# Altium schematic sheet External_Stepper.SchDoc
size B; Author: AM; CompanyName: Expatria Technologies; DrawnBy: A.Marles; Engineer: AM; Organization: Expatria Technolgoies; Address1: PO Box 2084; Address3: Merritt, BC V1K 1B8; Address4: Canada; DocumentNumber: 16; Revision: A2; SheetNumber: 13; SheetTotal: 26
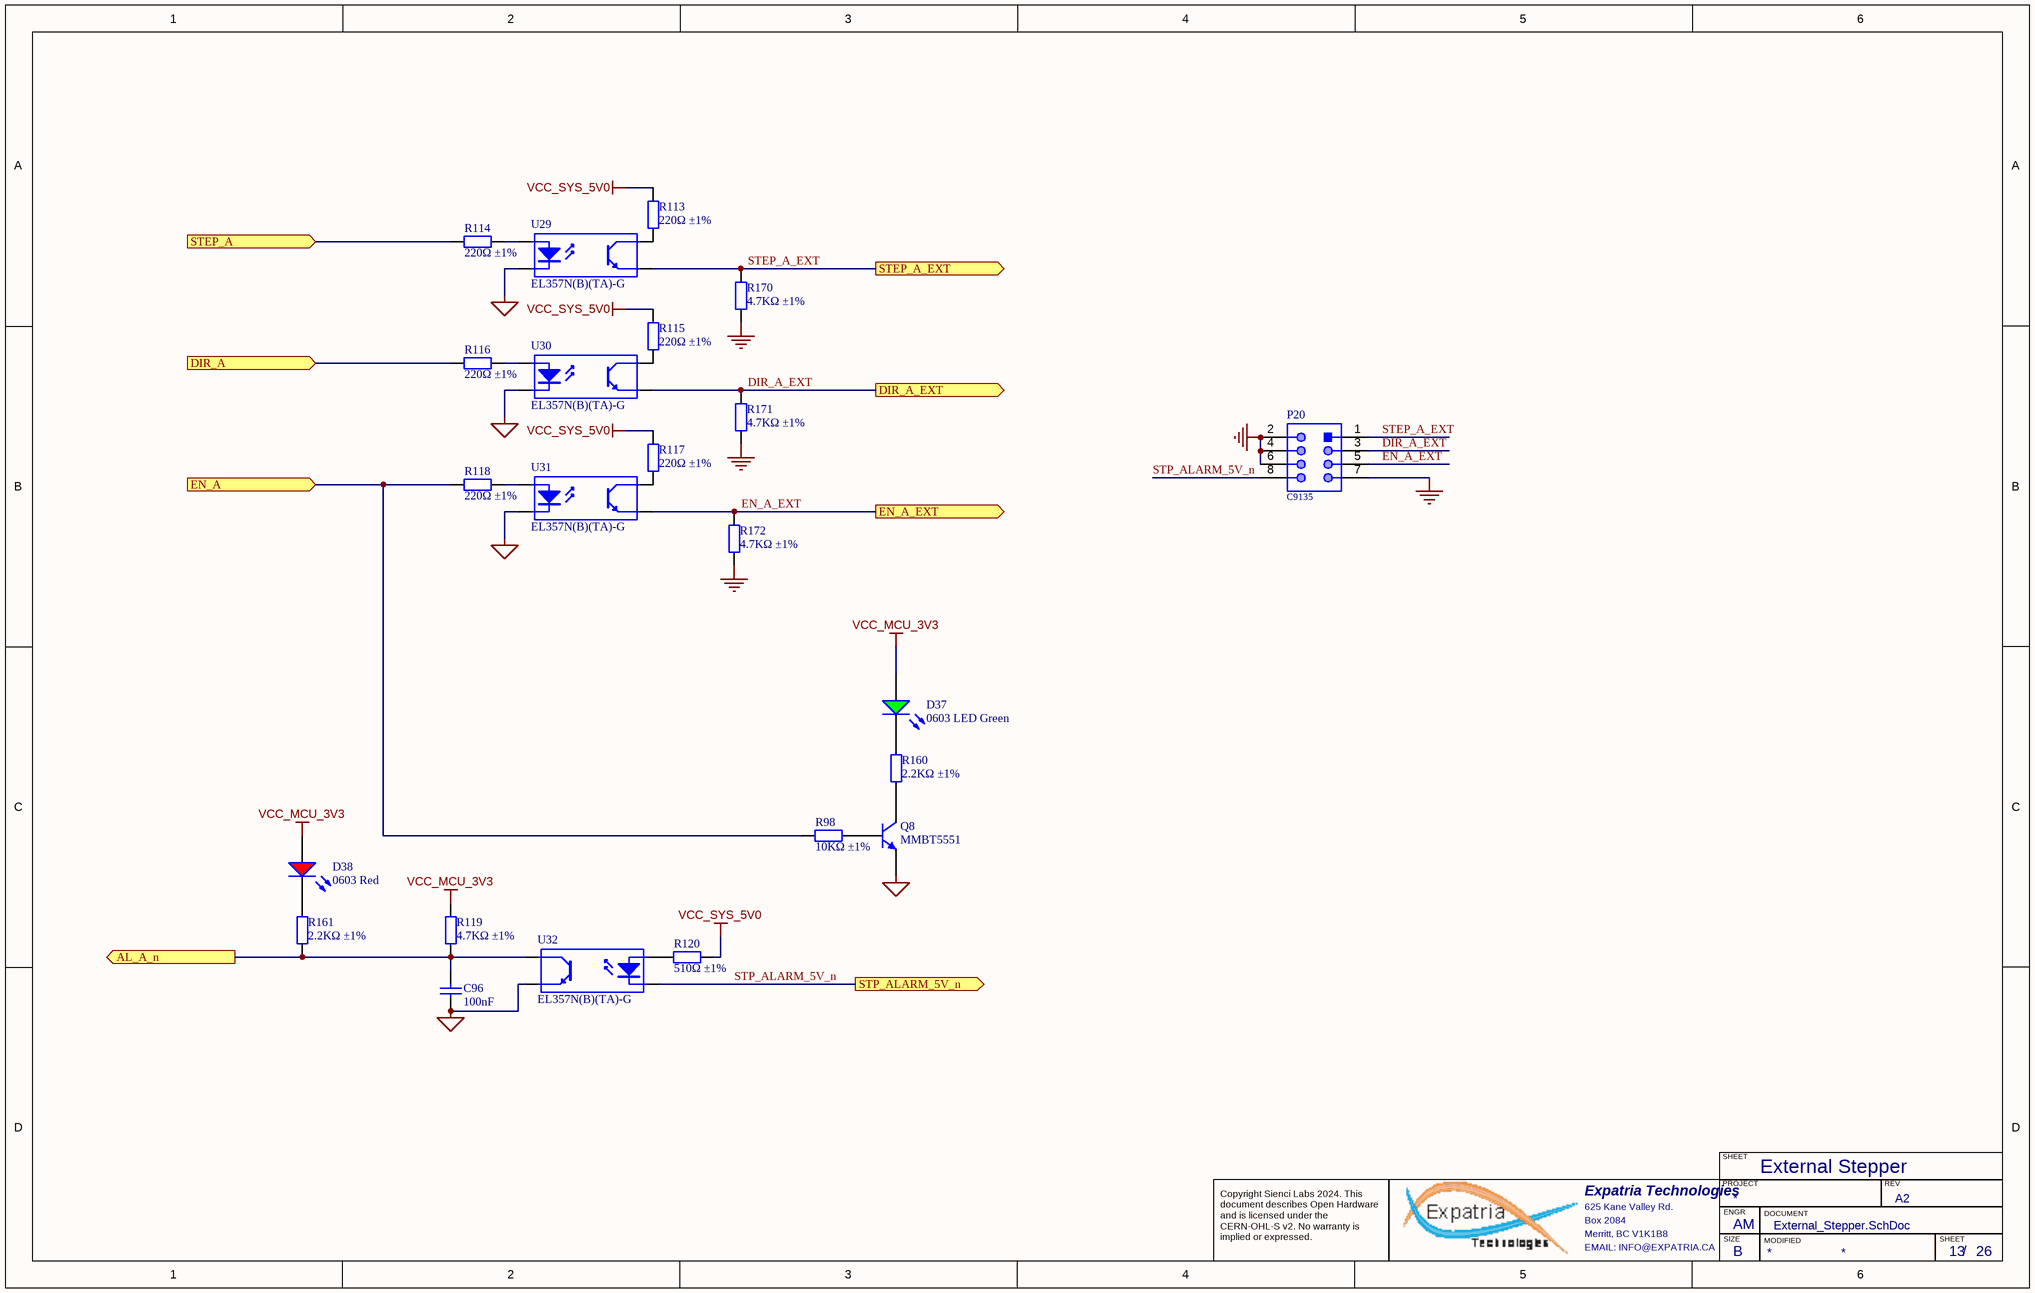
[diagram p0: External_Stepper.SchDoc]

## Parts
C96  100nF  [0402_C]
D37  0603 LED Green  [0603_LED_S1 - GREEN]
D38  0603 Red  [0603_LED_S1]
P20  C9135  [61200821621]
Q8  MMBT5551  [SOT-23(SOT-23-3)]
R98  10KΩ ±1%  [0603_R]
R113  220Ω ±1%  [0402_R]
R114  220Ω ±1%  [0402_R]
R115  220Ω ±1%  [0402_R]
R116  220Ω ±1%  [0402_R]
R117  220Ω ±1%  [0402_R]
R118  220Ω ±1%  [0402_R]
R119  4.7KΩ ±1%  [0402_R]
R120  510Ω ±1%  [0402_R]
R160  2.2KΩ ±1%  [0402_R]
R161  2.2KΩ ±1%  [0402_R]
R170  4.7KΩ ±1%  [0402_R]
R171  4.7KΩ ±1%  [0402_R]
R172  4.7KΩ ±1%  [0402_R]
U29  EL357N(B)(TA)-G  [SOP-4_P2.54]
U30  EL357N(B)(TA)-G  [SOP-4_P2.54]
U31  EL357N(B)(TA)-G  [SOP-4_P2.54]
U32  EL357N(B)(TA)-G  [SOP-4_P2.54]

## Ports
AL_A_n (out), DIR_A (in), DIR_A_EXT (out), EN_A (in), EN_A_EXT (out), STEP_A (in), STEP_A_EXT (out), STP_ALARM_5V_n (out)

## Nets
GND: P20.2 P20.4 P20.6 P20.7 R170.2 R171.2 R172.2
MCU_GND: C96.1 Q8.2(E) U29.2(K) U30.2(K) U31.2(K) U32.3(E)
VCC_MCU_3V3: D37.A D38.A R119.2
VCC_SYS_5V0: R113.1 R115.1 R117.1 R120.2
AL_A_n: C96.2 R119.1 R161.1 U32.4(C) ; port AL_A_n
DIR_A: R116.1 ; port DIR_A
DIR_A_EXT: P20.3 R171.1 U30.3(E) ; port DIR_A_EXT
EN_A: R98.2 R118.1 ; port EN_A
EN_A_EXT: P20.5 R172.1 U31.3(E) ; port EN_A_EXT
STEP_A: R114.1 ; port STEP_A
STEP_A_EXT: P20.1 R170.1 U29.3(E) ; port STEP_A_EXT
STP_ALARM_5V_n: P20.8 U32.2(K) ; port STP_ALARM_5V_n
NetD37_K: D37.K R160.2
NetD38_K: D38.K R161.2
NetQ8_1: Q8.1(B) R98.1
NetQ8_3: Q8.3(C) R160.1
NetR113_2: R113.2 U29.4(C)
NetR114_2: R114.2 U29.1(A)
NetR115_2: R115.2 U30.4(C)
NetR116_2: R116.2 U30.1(A)
NetR117_2: R117.2 U31.4(C)
NetR118_2: R118.2 U31.1(A)
NetR120_1: R120.1 U32.1(A)

## Notes on the sheet
- External Stepper
- SHEET
- Expatria Technologies
- 625 Kane Valley Rd.
- Box 2084
- Merritt, BC V1K1B8
- PROJECT
- SIZE
- ENGR
- MODIFIED
- DOCUMENT
- REV
- Copyright Sienci Labs 2024. This document describes Open Hardware and is licensed under the CERN-OHL-S v2. No warranty is implied or expressed.
- EMAIL: INFO@EXPATRIA.CA
- B
- /

## Library data of the parts
C96 = 0402 100nF (104) 10% 16V: 16V 100nF X7R ±10% 0402 Multilayer Ceramic Capacitors MLCC - SMD/SMT ROHS; Manufacturer: Samsung Electro-Mechanics; Manufacturer Part Number: CL05B104KO5NNNC; ComponentLink1Description: Supplier link; ComponentLink1URL: http://www.szlcsc.com/product/details_1877.html; Package: 0402; Supplier: LC; SuppliersPartNumber: C1525; Capacitance: 100nF; Tolerance: 10%; Voltage: 16V
D37 = 19-217/GHC-YR1S2/3T: Colorless transparence -40℃~+85℃ 520nm~535nm Emerald 120° 110mW 0603 Light Emitting Diodes (LED) ROHS; Manufacturer: Everlight Elec; Package: 0603; Supplier: LC; SuppliersPartNumber: C72043; Color: Green; Manufacturer Part Number: 19-217/GHC-YR1S2/3T
D38 = 19-213SURC/S530-A3/TR8: 20mA 632nm Colorless transparence 624nm~624nm -40℃~+85℃ Red 120° 60mW 0603 Light Emitting Diodes (LED) ROHS; Manufacturer: Everlight Elec; Package: 0603; Supplier: LC; SuppliersPartNumber: C72039; Color: Red; ComponentLink1Description: 供应商链接; ComponentLink1URL: http://www.szlcsc.com/product/details_2659.html; Supplier 1: LC; Supplier Part Number 1: C72039; Manufacturer Part Number: 19-213SURC/S530-A3/TR8
P20 = HDR2x4P: Male Box Header WR-BHD, THT, Vertical, pitch 2.54 mm, 8 pins; Manufacturer: Wurth Electronics; Pitch: 2.54mm; Publisher: WurthElektronik; Manufacturer Part Number: C9135; Packaging: Tray; Published Date: August2018; Manufacturer Part Number: 61200821621; SuppliersPartNumber: C9135; Supplier: LCSC
Q8 = MMBT5551: 50nA 160V 300mW 200@10mA,5V 600mA 100MHz 200mV@50mA,5mA NPN +150℃@(Tj) SOT-23-3 Bipolar Transistors - BJT ROHS; Manufacturer: Jiangsu Changjing Electronics Technology; Package: SOT-23; Supplier: LCSC; SuppliersPartNumber: C2145; Manufacturer Part Number: MMBT5551; Value: MMBT5551
R98 = 0603 10K (1002) 1%: Chip resistor; Manufacturer: Uniroyal Elec; Manufacturer Part Number: 0603WAF1002T5E; Power: 1/10W; Package: 0603; Supplier: LCSC; SuppliersPartNumber: C25804; Resistance: 10KΩ; Tolerance: 1%; ComponentLink1Description: Supplier link; ComponentLink1URL: http://www.szlcsc.com/product/details_26547.html
R113-R118 = 0402 220R (2200) 1%: Chip resistor; Manufacturer: Uniroyal Elec; Manufacturer Part Number: 0402WGF2200TCE; Power: 1/16W; Package: 0402; Supplier: LC; SuppliersPartNumber: C25091; Resistance: 220Ω; Tolerance: 1%; ComponentLink1Description: Supplier link; ComponentLink1URL: http://www.szlcsc.com/product/details_25834.html
R119 R170-R172 = 0402 4.7K (4701) 1%: Chip resistor; Manufacturer: Uniroyal Elec; Manufacturer Part Number: 0402WGF4701TCE; Power: 1/16W; ComponentLink1Description: Supplier link; ComponentLink1URL: http://www.szlcsc.com/product/details_26643.html; Package: 0402; Supplier: LC; SuppliersPartNumber: C25900; Resistance: 4.7KΩ; Tolerance: 1%
R120 = 0402 510R (5100) 1%: Chip resistor; Manufacturer: Uniroyal Elec; Manufacturer Part Number: 0402WGF5100TCE; Power: 1/16W; ComponentLink1Description: Supplier link; ComponentLink1URL: http://www.szlcsc.com/product/details_25866.html; Package: 0402; Supplier: LC; SuppliersPartNumber: C25123; Resistance: 510Ω; Tolerance: 1%
R160 R161 = 0402 2.2K (2201) 1%: Chip resistor; Manufacturer: Uniroyal Elec; Manufacturer Part Number: 0402WGF2201TCE; Power: 1/16W; ComponentLink1Description: Supplier link; ComponentLink1URL: http://www.szlcsc.com/product/details_26622.html; Package: 0402; Supplier: LC; SuppliersPartNumber: C25879; Resistance: 2.2KΩ; Tolerance: 1%
U29-U32 = EL357N(B)(TA)-G_[C6649]: 80V 3750V 50mA 0.1V@1mA,20mA 1 6V 1.2V DC SOP-4-2.54mm Optocouplers - Phototransistor Output ROHS; Manufacturer 1: Everlight Elec; ComponentLink1Description: 供应商链接; ComponentLink1URL: http://www.szlcsc.com/product/details_7114.html; Package: SOP-4_P2.54; Supplier: LCSC; SuppliersPartNumber: C6649; Manufacturer Part Number 1: EL357N(B)(TA)-G; Manufacturer: Everlight Elec; Manufacturer Part Number: EL357N(B)(TA)-G